# Altium schematic sheet RFMC_DAC.SchDoc: RFMC
size 420 x 297 mm; Author: T. Przywozki; CompanyName: WUT ISE; DrawnBy: T. Przywozki; Organization: WUT ISE; Address1: Warsaw University of Technology; Address2: Nowowiejska 15/19 00-665 Warsaw; Address3: Tomasz.Przywozki@pw.edu.pl; Revision: 1.0; SheetNumber: 3; SheetTotal: 4; ModifiedBy: -; CheckedDate: -; DivGrp: ISE; Designer: T. Przywozki; Project: RFMC
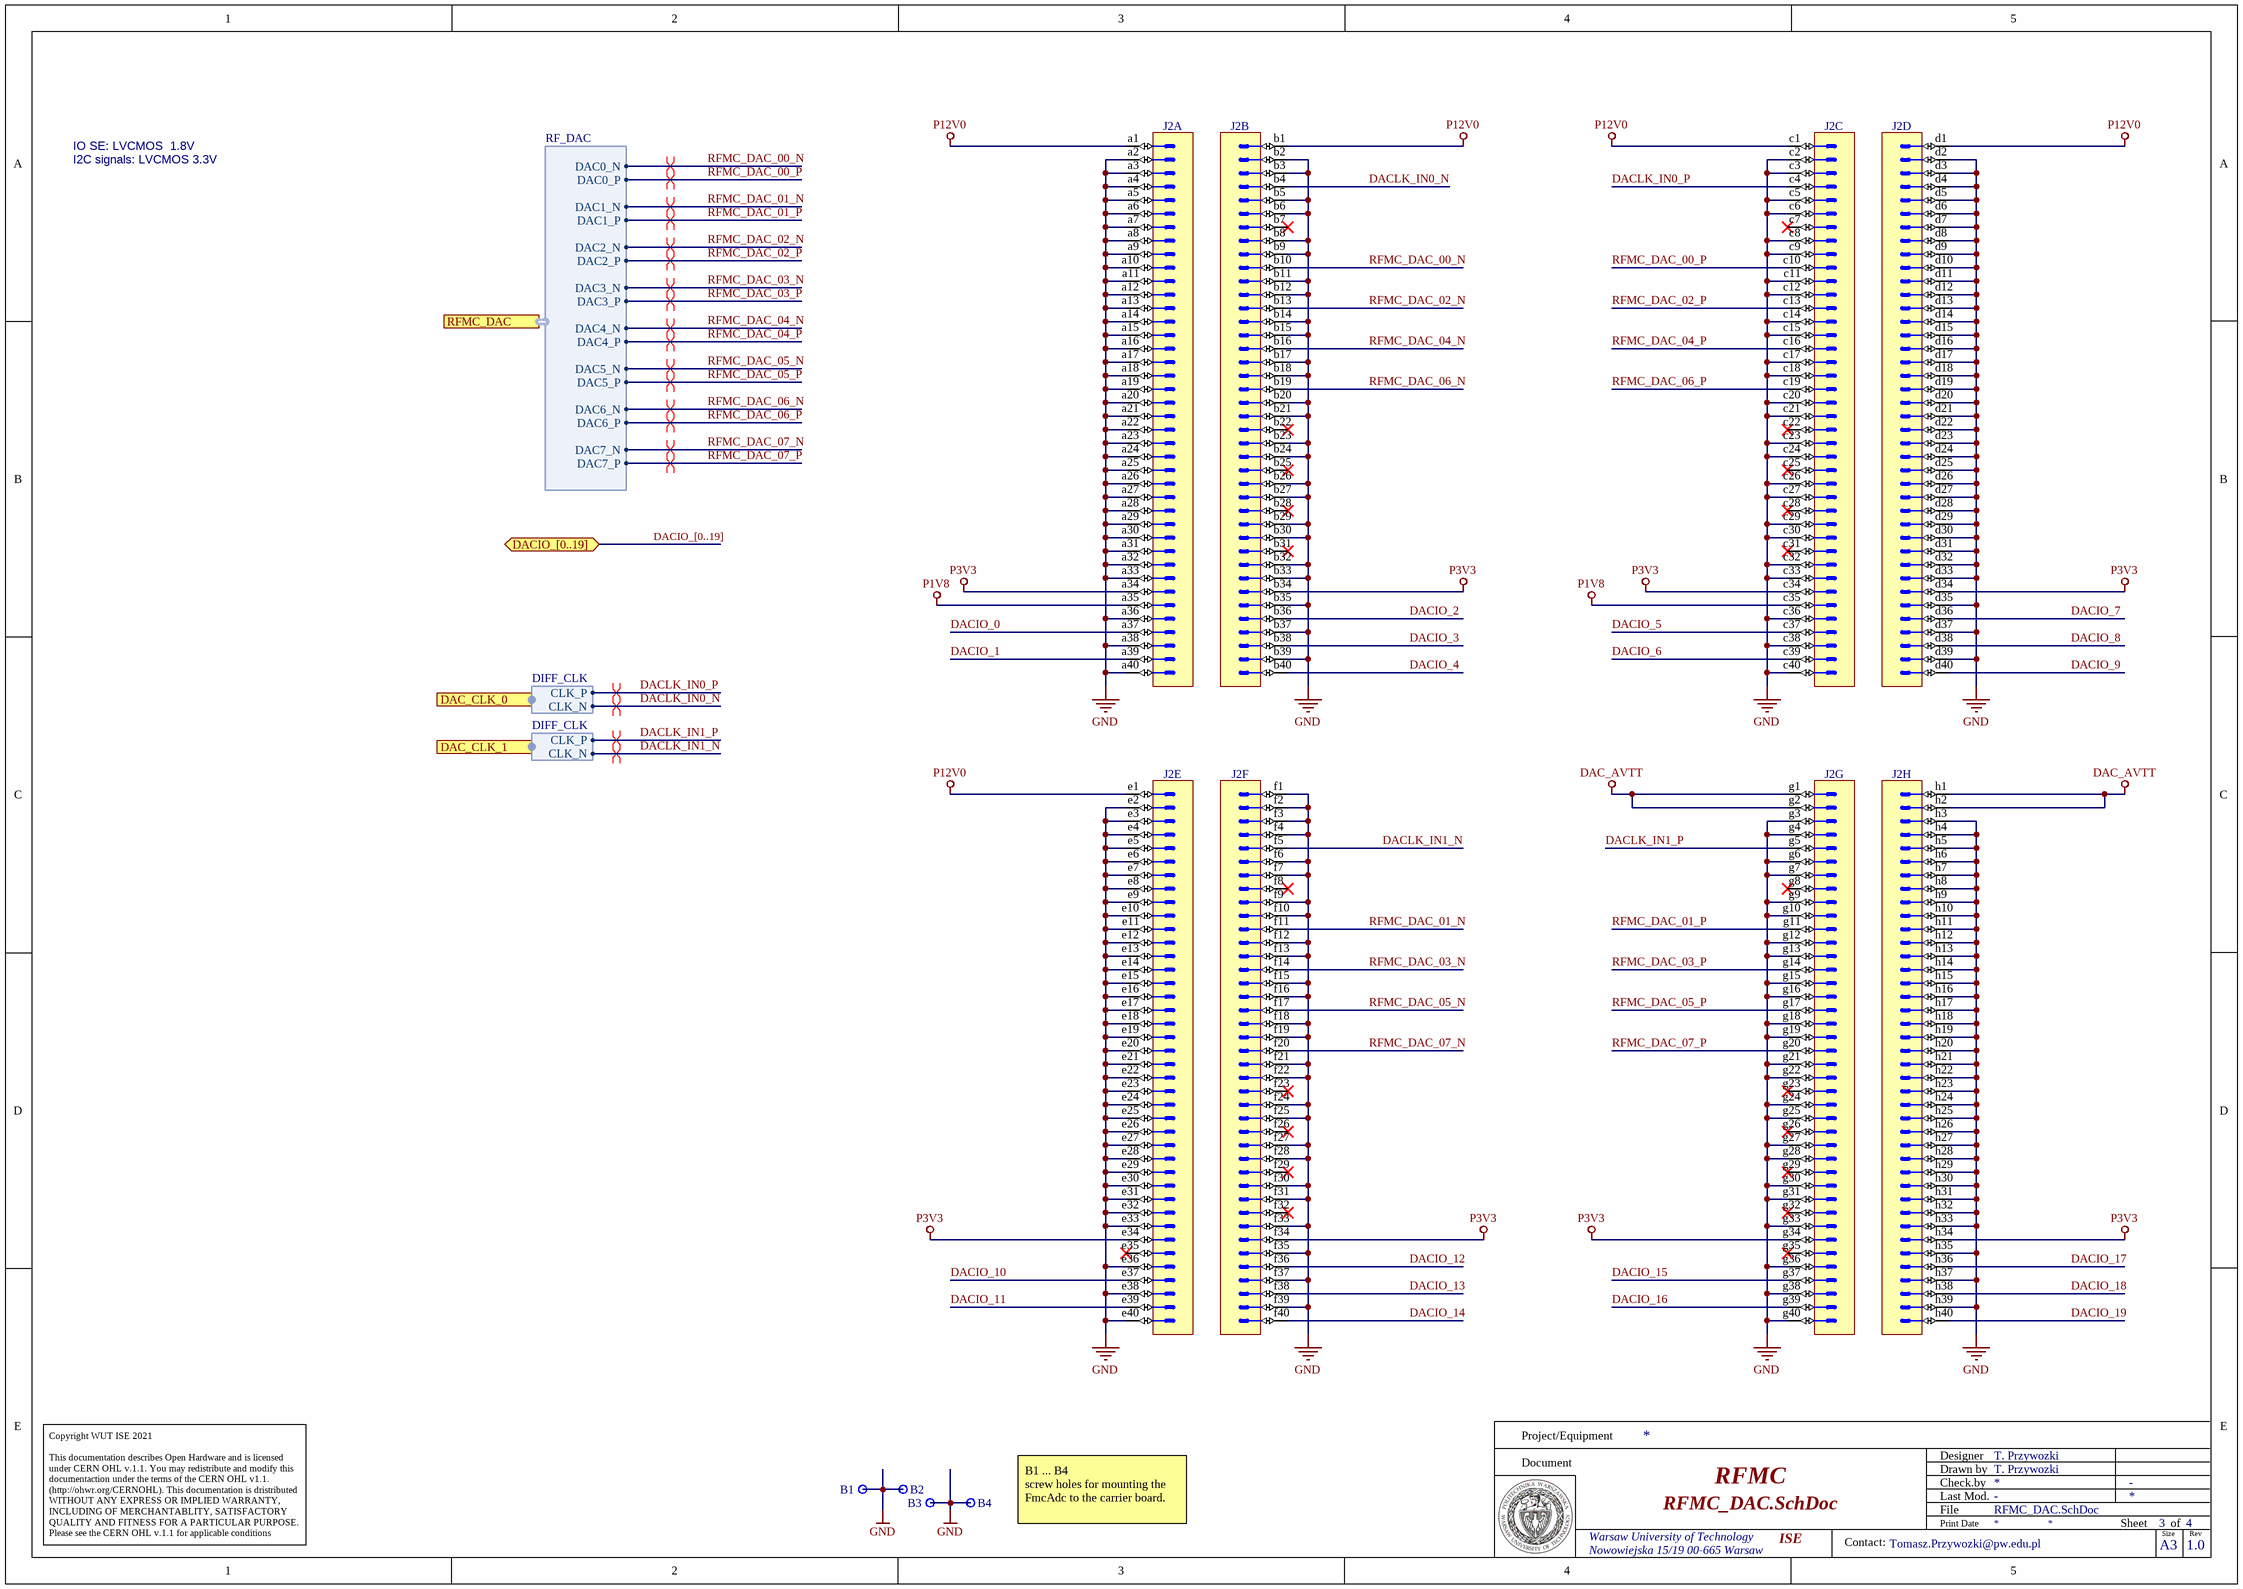
[diagram p0: RFMC_DAC.SchDoc]

## Parts
B1  Plated Hole  [MTG270_500]  (value not drawn)
B2  Plated Hole  [MTG270_500]  (value not drawn)
B3  Plated Hole  [MTG270_500]  (value not drawn)
B4  Plated Hole  [MTG270_500]  (value not drawn)
J2  (no value)  [SAMTEC_LPAM-40-01.0-S-08]  (parts A,B,C,D,E,F,G,H of 8)

## Ports
DAC_CLK_0 (harness DIFF_CLK), DAC_CLK_1 (harness DIFF_CLK), DACIO_[0..19] (bidir), RFMC_DAC (harness RF_DAC)

## Harnesses
RF_DAC: DAC0_N, DAC0_P, DAC1_N, DAC1_P, DAC2_N, DAC2_P, DAC3_N, DAC3_P, DAC4_N, DAC4_P, DAC5_N, DAC5_P, DAC6_N, DAC6_P, DAC7_N, DAC7_P
DIFF_CLK: CLK_P, CLK_N

## Nets
DAC_AVTT: J2.g1 J2.g2 J2.h1 J2.h2
GND: B1.1 B2.1 B3.1 B4.1 J2.a2 J2.a3 J2.a4 J2.a5 J2.a6 J2.a7 J2.a8 J2.a9 J2.a10 J2.a11 J2.a12 J2.a13 J2.a14 J2.a15 J2.a16 J2.a17 J2.a18 J2.a19 J2.a20 J2.a21 J2.a22 J2.a23 J2.a24 J2.a25 J2.a26 J2.a27 J2.a28 J2.a29 J2.a30 J2.a31 J2.a32 J2.a33 J2.a36 J2.a38 J2.a40 J2.b2 J2.b3 J2.b5 J2.b6 J2.b8 J2.b9 J2.b11 J2.b12 J2.b14 J2.b15 J2.b17 J2.b18 J2.b20 J2.b21 J2.b23 J2.b24 J2.b26 J2.b27 J2.b29 J2.b30 J2.b32 J2.b33 J2.b35 J2.b37 J2.b39 J2.c2 J2.c3 J2.c5 J2.c6 J2.c8 J2.c9 J2.c11 J2.c12 J2.c14 J2.c15 J2.c17 J2.c18 J2.c20 J2.c21 J2.c23 J2.c24 J2.c26 J2.c27 J2.c29 J2.c30 J2.c32 J2.c33 J2.c36 J2.c38 J2.c40 J2.d2 J2.d3 J2.d4 J2.d5 J2.d6 J2.d7 J2.d8 J2.d9 J2.d10 J2.d11 J2.d12 J2.d13 J2.d14 J2.d15 J2.d16 J2.d17 J2.d18 J2.d19 J2.d20 J2.d21 J2.d22 J2.d23 J2.d24 J2.d25 J2.d26 J2.d27 J2.d28 J2.d29 J2.d30 J2.d31 J2.d32 J2.d33 J2.d35 J2.d37 J2.d39 J2.e2 J2.e3 J2.e4 J2.e5 J2.e6 J2.e7 J2.e8 J2.e9 J2.e10 J2.e11 J2.e12 J2.e13 J2.e14 J2.e15 J2.e16 J2.e17 J2.e18 J2.e19 J2.e20 J2.e21 J2.e22 J2.e23 J2.e24 J2.e25 J2.e26 J2.e27 J2.e28 J2.e29 J2.e30 J2.e31 J2.e32 J2.e33 J2.e36 J2.e38 J2.e40 J2.f1 J2.f2 J2.f3 J2.f4 J2.f6 J2.f7 J2.f9 J2.f10 J2.f12 J2.f13 J2.f15 J2.f16 J2.f18 J2.f19 J2.f21 J2.f22 J2.f24 J2.f25 J2.f27 J2.f28 J2.f30 J2.f31 J2.f33 J2.f35 J2.f37 J2.f39 J2.g3 J2.g4 J2.g6 J2.g7 J2.g9 J2.g10 J2.g12 J2.g13 J2.g15 J2.g16 J2.g18 J2.g19 J2.g21 J2.g22 J2.g24 J2.g25 J2.g27 J2.g28 J2.g30 J2.g31 J2.g33 J2.g36 J2.g38 J2.g40 J2.h3 J2.h4 J2.h5 J2.h6 J2.h7 J2.h8 J2.h9 J2.h10 J2.h11 J2.h12 J2.h13 J2.h14 J2.h15 J2.h16 J2.h17 J2.h18 J2.h19 J2.h20 J2.h21 J2.h22 J2.h23 J2.h24 J2.h25 J2.h26 J2.h27 J2.h28 J2.h29 J2.h30 J2.h31 J2.h32 J2.h33 J2.h35 J2.h37 J2.h39
P1V8: J2.a35 J2.c35
P3V3: J2.a34 J2.b34 J2.c34 J2.d34 J2.e34 J2.f34 J2.g34 J2.h34
P12V0: J2.a1 J2.b1 J2.c1 J2.d1 J2.e1
DACIO_0: J2.a37
DACIO_1: J2.a39
DACIO_2: J2.b36
DACIO_3: J2.b38
DACIO_4: J2.b40
DACIO_5: J2.c37
DACIO_6: J2.c39
DACIO_7: J2.d36
DACIO_8: J2.d38
DACIO_9: J2.d40
DACIO_10: J2.e37
DACIO_11: J2.e39
DACIO_12: J2.f36
DACIO_13: J2.f38
DACIO_14: J2.f40
DACIO_15: J2.g37
DACIO_16: J2.g39
DACIO_17: J2.h36
DACIO_18: J2.h38
DACIO_19: J2.h40
DACLK_IN0_N: J2.b4 ; port DAC_CLK_0.CLK_N
DACLK_IN0_P: J2.c4 ; port DAC_CLK_0.CLK_P
DACLK_IN1_N: J2.f5 ; port DAC_CLK_1.CLK_N
DACLK_IN1_P: J2.g5 ; port DAC_CLK_1.CLK_P
RFMC_DAC_00_N: J2.b10 ; port RFMC_DAC.DAC0_N
RFMC_DAC_00_P: J2.c10 ; port RFMC_DAC.DAC0_P
RFMC_DAC_01_N: J2.f11 ; port RFMC_DAC.DAC1_N
RFMC_DAC_01_P: J2.g11 ; port RFMC_DAC.DAC1_P
RFMC_DAC_02_N: J2.b13 ; port RFMC_DAC.DAC2_N
RFMC_DAC_02_P: J2.c13 ; port RFMC_DAC.DAC2_P
RFMC_DAC_03_N: J2.f14 ; port RFMC_DAC.DAC3_N
RFMC_DAC_03_P: J2.g14 ; port RFMC_DAC.DAC3_P
RFMC_DAC_04_N: J2.b16 ; port RFMC_DAC.DAC4_N
RFMC_DAC_04_P: J2.c16 ; port RFMC_DAC.DAC4_P
RFMC_DAC_05_N: J2.f17 ; port RFMC_DAC.DAC5_N
RFMC_DAC_05_P: J2.g17 ; port RFMC_DAC.DAC5_P
RFMC_DAC_06_N: J2.b19 ; port RFMC_DAC.DAC6_N
RFMC_DAC_06_P: J2.c19 ; port RFMC_DAC.DAC6_P
RFMC_DAC_07_N: J2.f20 ; port RFMC_DAC.DAC7_N
RFMC_DAC_07_P: J2.g20 ; port RFMC_DAC.DAC7_P

Not connected (* = marked no-connect by the designer): J2 b7* b22* b25* b28* b31* c7* c22* c25* c28* c31* e35* f8* f23* f26* f29* f32* g8* g23* g26* g29* g32* g35*

## Buses and harness runs
bus DACIO_[0..19] = port DACIO_[0..19]

## Layout directives
differential pair: DACLK_IN0_N, DACLK_IN0_P, DACLK_IN1_N, DACLK_IN1_P
differential pair; differential pair class Analog: RFMC_DAC_00_N, RFMC_DAC_00_P, RFMC_DAC_01_N, RFMC_DAC_01_P, RFMC_DAC_02_N, RFMC_DAC_02_P, RFMC_DAC_03_N, RFMC_DAC_03_P, RFMC_DAC_04_N, RFMC_DAC_04_P, RFMC_DAC_05_N, RFMC_DAC_05_P, RFMC_DAC_06_N, RFMC_DAC_06_P, RFMC_DAC_07_N, RFMC_DAC_07_P

## Notes on the sheet
- I2C signals: LVCMOS 3.3V
- IO SE: LVCMOS  1.8V
- (near B4) B1 ... B4
  screw holes for mounting the FmcAdc to the carrier board.
- Project/Equipment
- Document
- Designer
- Drawn by
- Check.by
- Copyright WUT ISE 2021
  This documentation describes Open Hardware and is licensed under CERN OHL v.1.1. You may redistribute and modify this documentaction under the terms of the CERN OHL v1.1.
  (http://ohwr.org/CERNOHL). This documentation is dristributed WITHOUT ANY EXPRESS OR IMPLIED WARRANTY, INCLUDING OF MERCHANTABLITY, SATISFACTORY QUALITY AND FITNESS FOR A PARTICULAR PURPOSE. Please see the CERN OHL v.1.1 for applicable conditions
- File
- Last Mod.
- Print Date
- Sheet
- Size
- A3
- of
- Rev
- Contact:

## Library data of the parts
B1-B4 = PLATED_HOLE2.7_PAD5.0: Single Terminal Socket; Part Description: Plated Through Hole: Hole Dia.=2.7mm Pad Dia.=5.0mm; Mounted: No; Part Number: PLATED_HOLE2.7_PAD5.0; Component Kind: Standard (No BOM); Component Type: Standard (No BOM); Pin Count: 1; Family: Plated Hole; Socket: No; SMD: No; Sense: No; Status: None; ComponentHeight: 0mm; HelpURL: Undefined; Author: CERN DEM JMW; CreateDate: 27.09.2011; LatestRevisionDate: 27.09.2011; PackageDescription: Plated Through Hole: Hole Dia.=2.7mm Pad Dia.=5.0mm
J2 = SAMTEC_LPAM-40-01.0-S-08-2-K: Connector 320 Male contacts in 8 row abcdef; Part Description: 320 Contacts (8x40), Pitch 1.27mm, Straight High Speed Low-Profile Open-Pin-Field Header; Manufacturer: SAMTEC; PressFit: No; Sense Comment: Solder Paste Deposition Sensitive – Check Manufacturer Recommendations for Stencil Design; Part Number: SAMTEC_LPAM-40-01.0-S-08-2-K; Component Kind: Standard; Component Type: Standard; Pin Count: 320; Mounted: Yes; Socket: No; SMD: Yes; Sense: Yes; Status: None; Manufacturer Part Number: LPAM-40-01.0-S-08-2-K; ComponentHeight: 3.68mm; HelpURL: \\cern.ch\dfs\Applications\Altium\Datasheets\SAMTEC_LPAM-40-01.0-S-08-2-K.pdf; Author: CERN DEM BC; CreateDate: 31.01.2020; LatestRevisionDate: 31.01.2020